# EAGLE design 04A-005 (EAGLE 6.3)
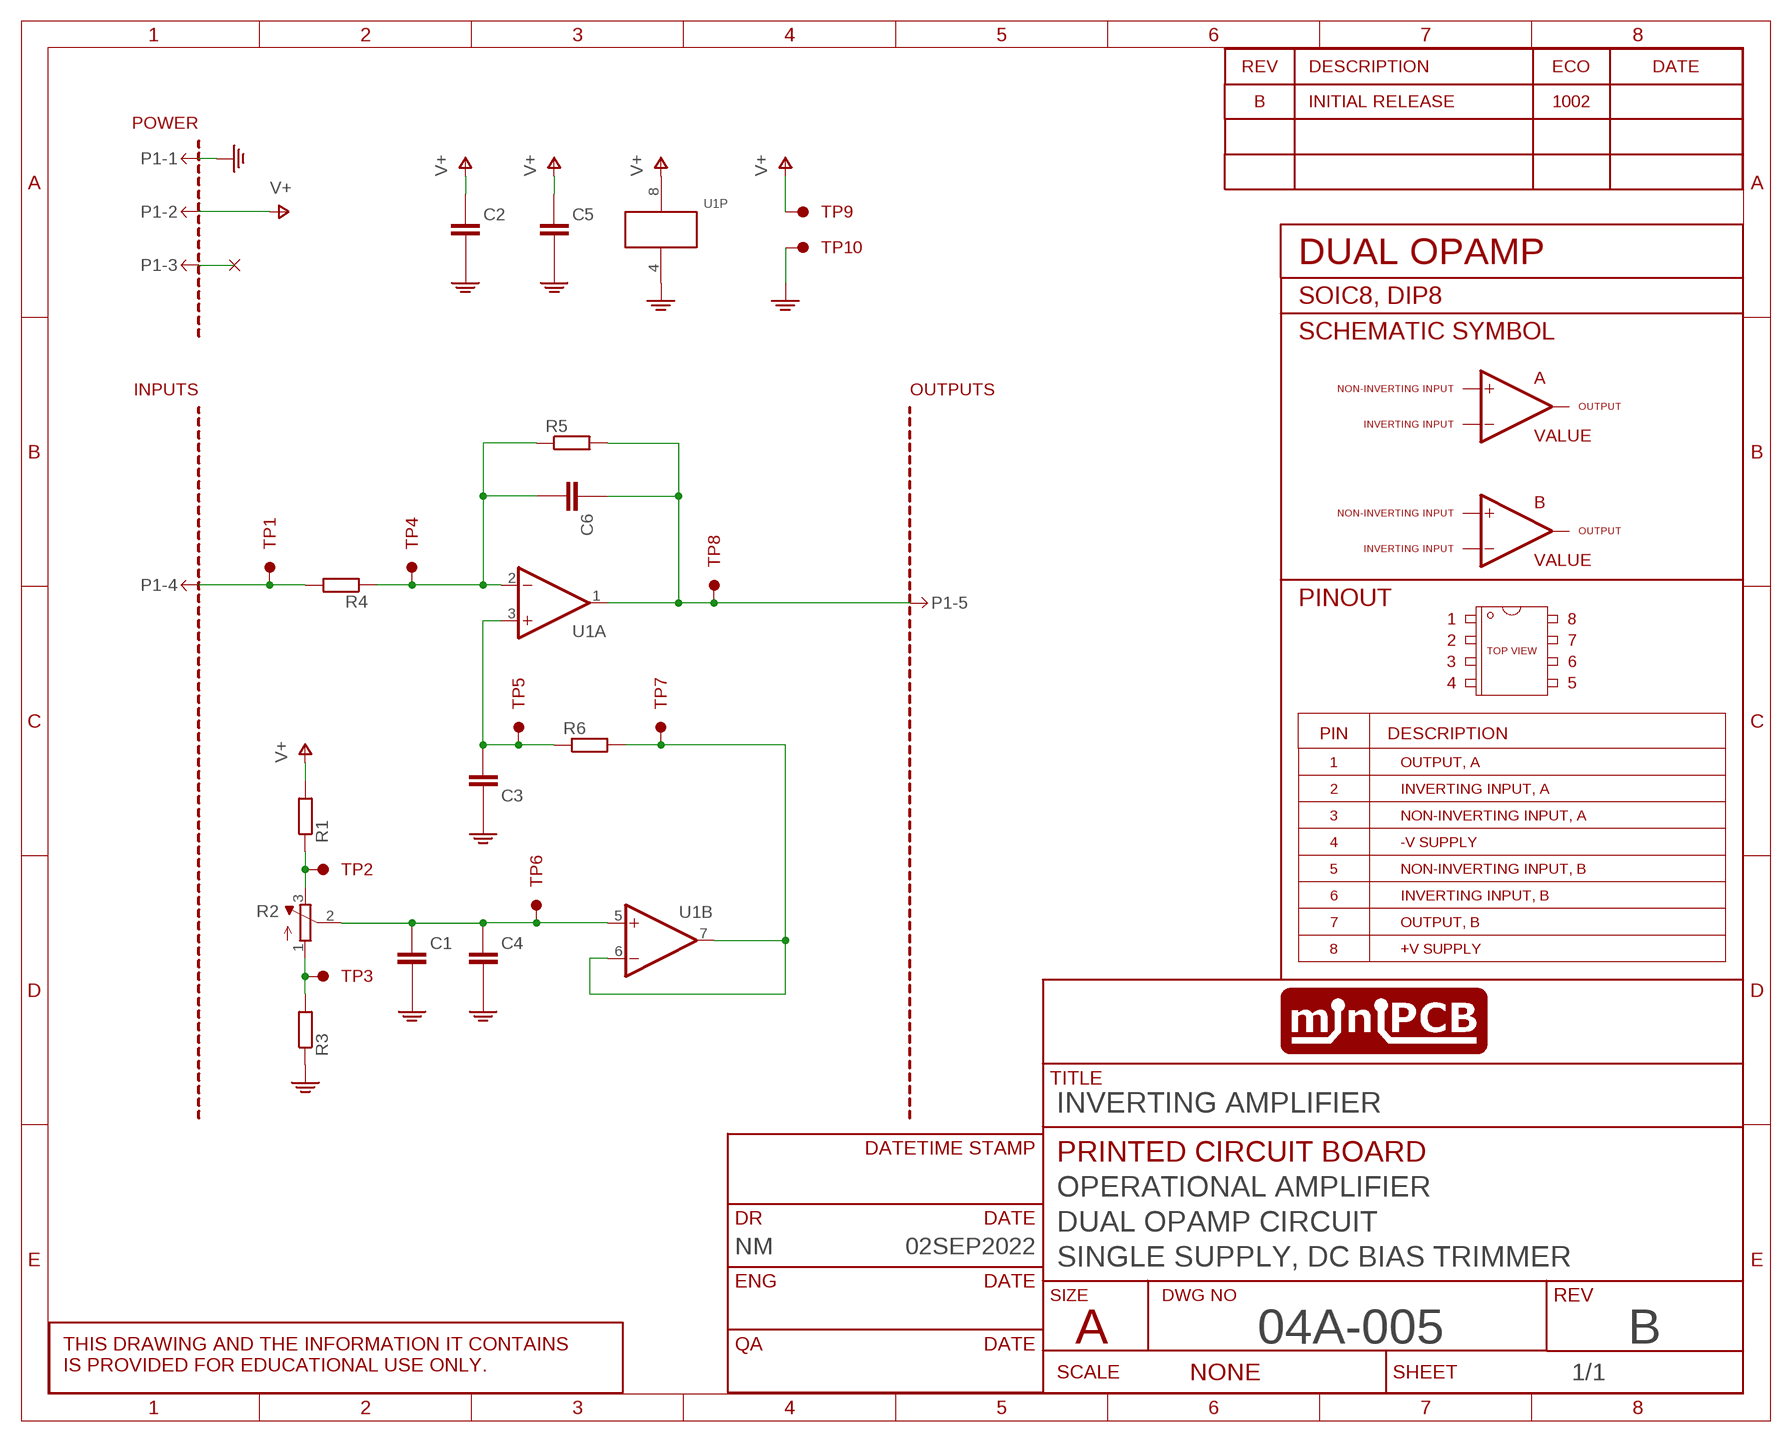
[diagram p0: schematic, sheet 1]
SHEET1 (SCHEMATIC): CIRCUIT_CATEGORY: OPERATIONAL AMPLIFIER; CIRCUIT_NAME: DUAL OPAMP CIRCUIT; CIRCUIT_VARIANT: SINGLE SUPPLY, DC BIAS TRIMMER; DR: NM; DR_DATE: 02SEP2022; REVA: B; REVA_ECO: 1002; REVISION: B; TITLE: INVERTING AMPLIFIER

## Parts
C1  CAPACITORTHD  [C050-024X044]
C2  CAPACITORTHD  [C050-024X044]
C3  CAPACITORTHD  [C050-024X044]
C4  CAPACITORTHD  [C050-024X044]
C5  CAPACITORTHD  [C050-024X044]
C6  CAPACITORTHD  [C050-024X044]
P1-  MINIPCB_5P50X50  [MINIPCB_5P_50X50MM]
R1  RESISTOR10MM  [0207/10]
R2  TRIMPOT0.100THD  [TRIM_0100]
R3  RESISTOR10MM  [0207/10]
R4  RESISTOR10MM  [0207/10]
R5  RESISTOR10MM  [0207/10]
R6  RESISTOR10MM  [0207/10]
TP1  TESTPOINTKE5000-SMTEXT  [PINS_1_TESTPOINT_KE5000_NOTEXT]
TP2  TESTPOINTKE5000-SMTEXT  [PINS_1_TESTPOINT_KE5000_NOTEXT]
TP3  TESTPOINTKE5000-SMTEXT  [PINS_1_TESTPOINT_KE5000_NOTEXT]
TP4  TESTPOINTKE5000-SMTEXT  [PINS_1_TESTPOINT_KE5000_NOTEXT]
TP5  TESTPOINTKE5000-SMTEXT  [PINS_1_TESTPOINT_KE5000_NOTEXT]
TP6  TESTPOINTKE5000-SMTEXT  [PINS_1_TESTPOINT_KE5000_NOTEXT]
TP7  TESTPOINTKE5000-SMTEXT  [PINS_1_TESTPOINT_KE5000_NOTEXT]
TP8  TESTPOINTKE5000-SMTEXT  [PINS_1_TESTPOINT_KE5000_NOTEXT]
TP9  TESTPOINTKE5000-SMTEXT  [PINS_1_TESTPOINT_KE5000_NOTEXT]
TP10  TESTPOINTKE5000-SMTEXT  [PINS_1_TESTPOINT_KE5000_NOTEXT]
U1  OPAMP_DUALTHD  [DIL08]

## Nets
GND: C1.2(-) C2.2(-) C3.1(+) C4.2(-) C5.2(-) P1-.1 R3.1 TP10.1 U1.4(P:V-)
IN: P1-.4 R4.2 TP1.1
N$1: C1.1(+) C4.1(+) R2.2(S) TP6.1 U1.5(B:+IN)
N$2: C3.2(-) R6.1 TP5.1 U1.3(A:+IN)
NC: P1-.3
OUT: C6.1(+) P1-.5 R5.2 TP8.1 U1.1(A:OUT)
P1.1: R2.1(A) R3.2 TP3.1
P1.3: R1.1 R2.3(E) TP2.1
V+: C2.1(+) C5.1(+) P1-.2 R1.2 TP9.1 U1.8(P:V+)
VFB: C6.2(-) R4.1 R5.1 TP4.1 U1.2(A:-IN)
VREF: R6.2 TP7.1 U1.6(B:-IN) U1.7(B:OUT)

## Library data of the parts
C1-C6 = minipcb:CAPACITOR
P1- = minipcb:MINIPCB_5P; PART_NUMBER: X04A-005-B; REVISION: B
R1 R3-R6 = minipcb:RESISTOR
R2 = minipcb:TRIMPOT: SMT trimmer potentiometer part number TC33X http://www.ladyada.net/library/eagle
TP1-TP10 = minipcb:TESTPOINT
U1 = minipcb:OPAMP_DUAL: OP AMP

## Board
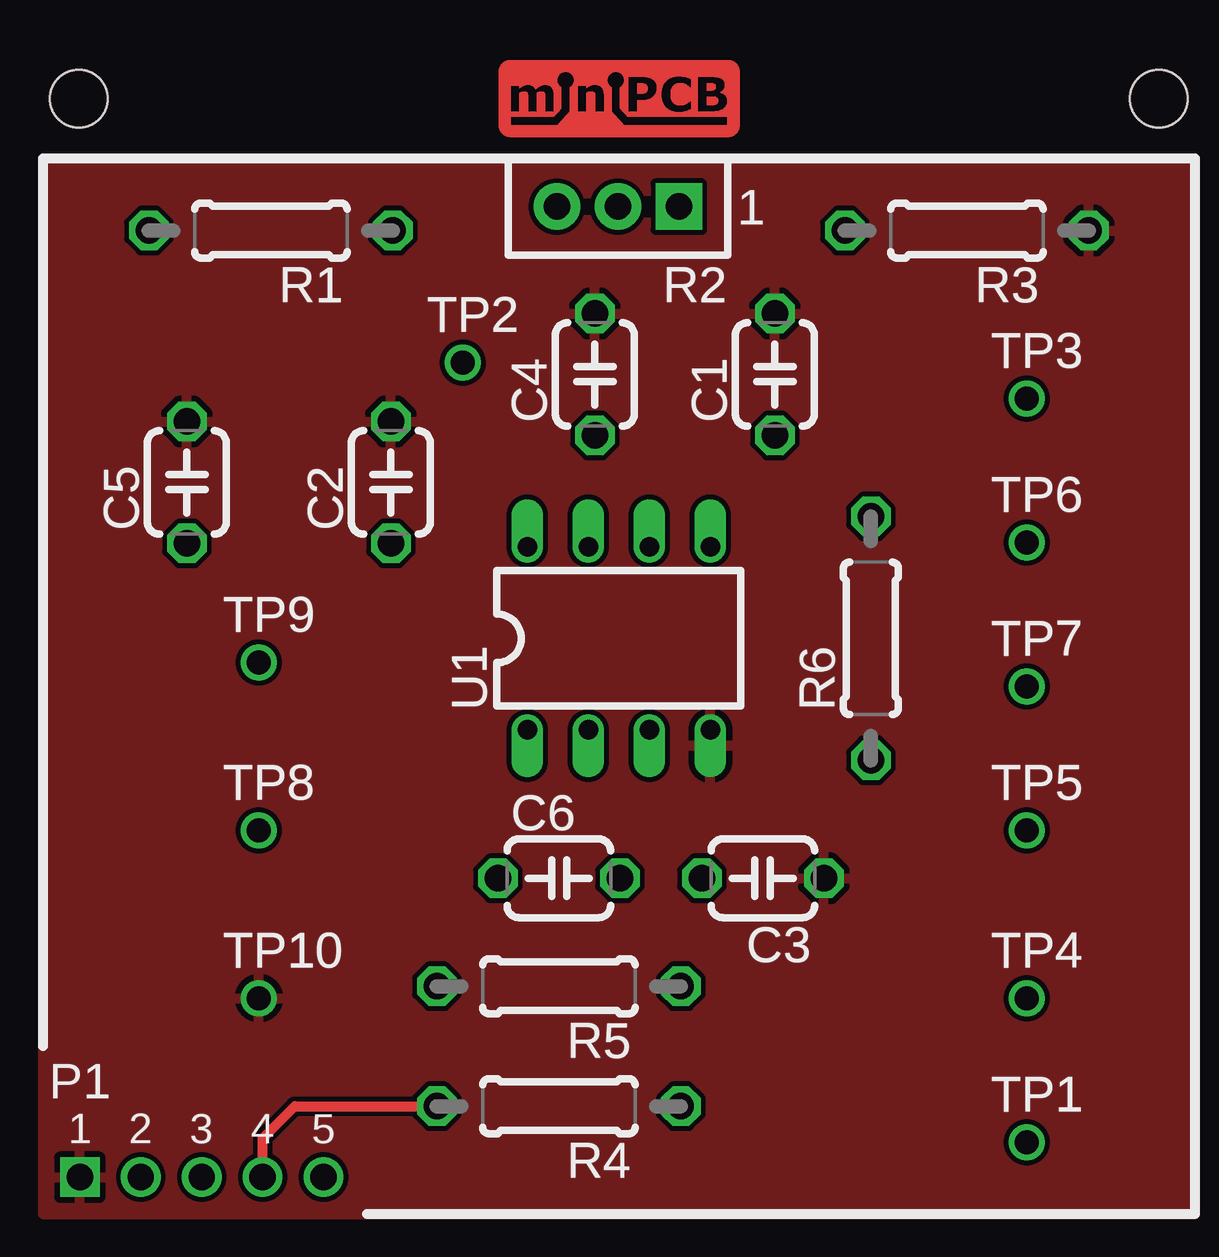
[diagram p1: board, top side]
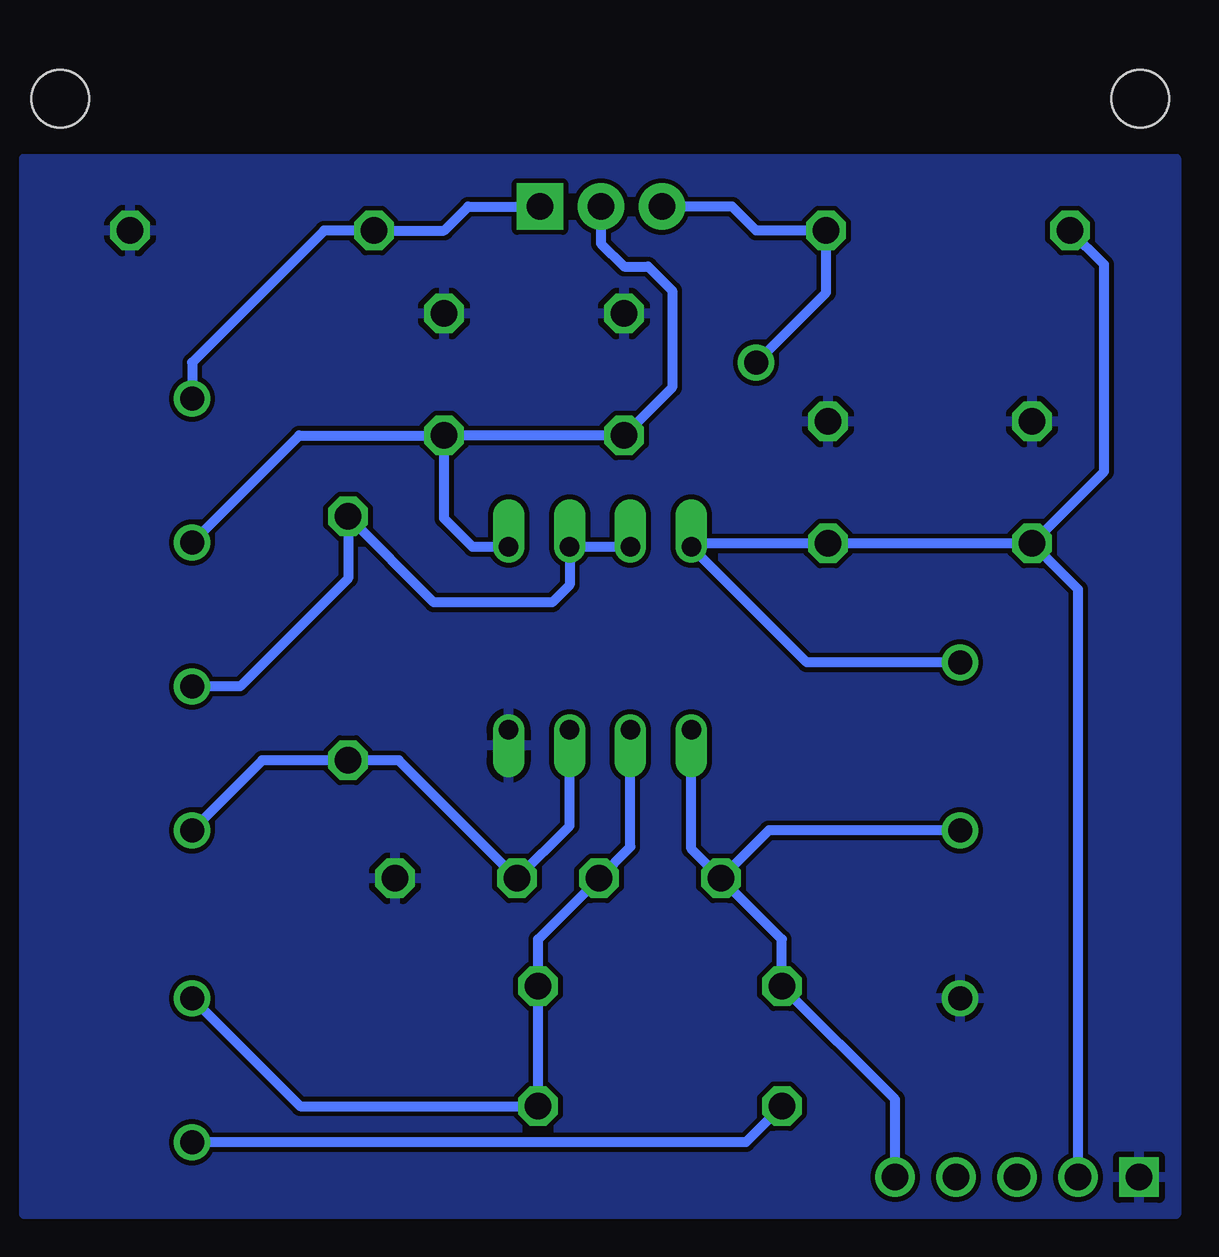
[diagram p2: board, bottom side, seen from below]

No outline drawn. Coordinates in mm, seen from the top.
Copper layers (1*16): Top 0.035mm / dielectric 1.5mm / Bottom 0.035mm
Design rules "minipcb": minimum track width 10mil, minimum drill 24mil, track to track 8mil, track to pad 8mil, pad to pad 8mil, via to via 8mil, smd to smd 8mil, copper to edge 40mil, drill to drill 8mil, minimum pad ring 10mil, minimum via ring 8mil, stop-mask expansion 4mil, vias tented up to drill 20mil, thermal gap 10mil

### Footprints (pad centres in the part's own frame; a part is rotated, then mirrored left to right if it is on the bottom)
C050-024X044 = drill 1.1 octagon: 1 -2.54,0; 2 2.54,0
MINIPCB_5P_50X50MM = drill 1.1 square: 1 2.54,2.54 | drill 1.1: 2 5.08,2.54; 3 7.62,2.54; 4 10.16,2.54; 5 12.7,2.54 | hole 2.4: 47.5,47.5; 2.5,47.5
0207/10 = drill 1.1 octagon: 1 -5.08,0; 2 5.08,0
TRIM_0100 = drill 1.1 pad 1.93 square: 1 0,0 | drill 1.1 pad 1.93: 2 2.54,0; 3 5.08,0
PINS_1_TESTPOINT_KE5000_NOTEXT = drill 1: 1 0,0
DIL08 = drill 0.813 offset: 1 -3.81,-3.81; 2 -1.27,-3.81; 3 1.27,-3.81; 4 3.81,-3.81; 5 3.81,3.81; 6 1.27,3.81; 7 -1.27,3.81; 8 -3.81,3.81

### Placement (x,y rotation side)
C1  31.5,36 90 top
C2  15.5,31.5 90 top
C3  31,15 180 top
C4  24,36 90 top
C5  7,31.5 90 top
C6  22.5,15 0 top
P1-  0,0 0 top
R1  10.5,42 180 top
R2  27.5,43 180 top
R3  39.5,42 180 top
R4  22.5,5.5 180 top
R5  22.5,10.5 180 top
R6  35.5,25 90 top
TP1  42,4 0 top
TP2  18.5,36.5 0 top
TP3  42,35 0 top
TP4  42,10 0 top
TP5  42,17 0 top
TP6  42,29 0 top
TP7  42,23 0 top
TP8  10,17 0 top
TP9  10,24 0 top
TP10  10,10 0 top
U1  25,25 0 top

### Tracks (layer width: path | path; a pad name or v marks a point on that pad's centre or on a via)
GND
  pour Top: 1,1 49,1 49,45 1,45
  pour Bottom: 1,1 49,1 49,45 1,45
IN
  Top 0.406: P1-.4 10.16,4.16 11.5,5.5 R4.2
  Bottom 0.406: R4.2 18.92,4 TP1.1
N$1
  Bottom 0.406: U1.5 30.31,28.81 31.5,30 C1.1 | R2.2 24.96,41.46 24,40.5 23,40.5 22,39.5 22,35.46 C4.1 C1.1 | TP6.1 37.54,33.46 C1.1
N$2
  Bottom 0.406: U1.3 26.27,17.19 C3.2 33.38,19.92 R6.1 39.08,19.92 TP5.1
OUT
  Bottom 0.406: P1-.5 12.7,5.78 R5.2 17.42,12.46 C6.1 | C6.1 21.19,16.23 U1.1 | TP8.1 17.96,17 C6.1
P1.1
  Bottom 0.406: R2.1 30.5,43 31.5,42 R3.2 36.5,42 42,36.5 TP3.1
P1.3
  Bottom 0.406: R2.3 19.5,43 18.5,42 R1.1 15.58,39.42 TP2.1
V+
  Bottom 0.406: C5.1 C2.1 21.19,28.96 U1.8 16.38,24 TP9.1 | P1-.2 5.08,27.04 C5.1 | C5.1 4,31.96 4,40.58 R1.2
VFB
  Bottom 0.406: U1.2 23.73,16.31 C6.2 27.58,12.46 R5.1 R4.1 37.5,5.5 TP4.1
VREF
  Bottom 0.406: U1.7 U1.6 26.27,27.23 27,26.5 31.92,26.5 R6.2 35.5,27.5 40,23 TP7.1

### Text on the board
_tNames: R1 | R2 | R3 | TP2 | TP3 | C4 | C1 | TP6 | C5 | C2 | TP9 | TP7 | U1 | R6 | TP8 | TP5 | C6 | C3 | TP10 | TP4 | R5 | TP1 | R4